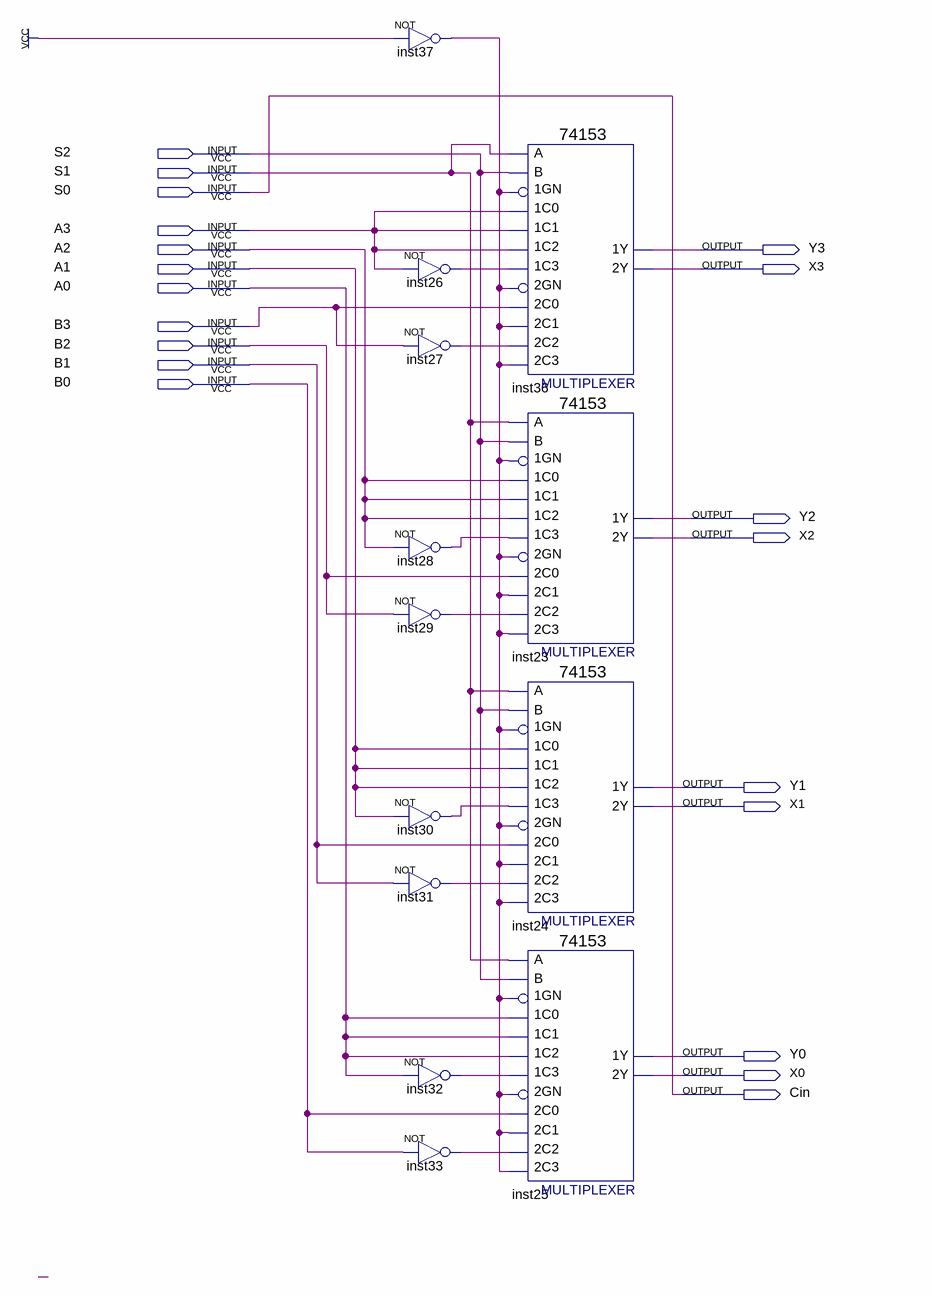
[diagram p0: schematic sheet]
// Quartus schematic arith_test.bdf as structural Verilog: 13 symbols, 20 pins
module arith_test (
  input  S2,
  input  S1,
  input  S0,
  input  A3,
  input  A2,
  input  A1,
  input  A0,
  input  B3,
  input  B2,
  input  B1,
  input  B0,
  output Y3,
  output X3,
  output Y2,
  output X2,
  output Y1,
  output X1,
  output Y0,
  output X0,
  output Cin
);

  wire inst26_out, inst27_out, inst28_out, inst29_out, inst30_out, inst31_out, inst32_out, inst33_out,
       inst37_out;

  not inst37 (inst37_out, 1'b1);
  not inst26 (inst26_out, A3);
  not inst27 (inst27_out, B3);
  not inst28 (inst28_out, A2);
  not inst29 (inst29_out, B2);
  not inst30 (inst30_out, A1);
  not inst31 (inst31_out, B1);
  not inst32 (inst32_out, A0);
  not inst33 (inst33_out, B0);
  \74153  inst36 (
    .\1C1 (A3), .\1GN (inst37_out), .\1C0 (A3), .\2C0 (B3), .\2GN (inst37_out), .\2C2 (inst27_out),
    .\1C2 (A3), .\1C3 (inst26_out), .B(S2), .A(S1), .\2C1 (inst37_out), .\2C3 (inst37_out), .\1Y (Y3),
    .\2Y (X3));
  \74153  inst23 (
    .\1C1 (A2), .\1GN (inst37_out), .\1C0 (A2), .\2C0 (B2), .\2GN (inst37_out), .\2C2 (inst29_out),
    .\1C2 (A2), .\1C3 (inst28_out), .B(S2), .A(S1), .\2C1 (inst37_out), .\2C3 (inst37_out), .\1Y (Y2),
    .\2Y (X2));
  \74153  inst24 (
    .\1C1 (A1), .\1GN (inst37_out), .\1C0 (A1), .\2C0 (B1), .\2GN (inst37_out), .\2C2 (inst31_out),
    .\1C2 (A1), .\1C3 (inst30_out), .B(S2), .A(S1), .\2C1 (inst37_out), .\2C3 (inst37_out), .\1Y (Y1),
    .\2Y (X1));
  \74153  inst25 (
    .\1C1 (A0), .\1GN (inst37_out), .\1C0 (A0), .\2C0 (B0), .\2GN (inst37_out), .\2C2 (inst33_out),
    .\1C2 (A0), .\1C3 (inst32_out), .B(S2), .A(S1), .\2C1 (inst37_out), .\2C3 (inst37_out), .\1Y (Y0),
    .\2Y (X0));

  assign Cin = S0;
endmodule
